# EAGLE design nixie-tube-clock_tube (EAGLE 9.6.2)
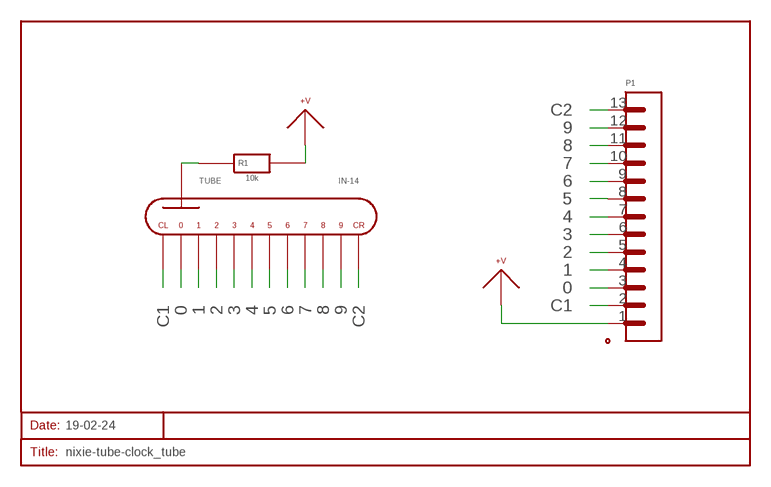
[diagram p0: schematic, sheet 1]

## Parts
P1  PORT_13-PIN_HEADER  [HEADER_13-PIN]
R1  10k  RESISTOR  [RESISTOR_10.16MM]
SCHEMATIC1  19-02-24  SHEET  [SHEET]
TUBE  IN-14  NIXIE-TUBE_IN-14_TUBE  [NIXIE-TUBE_IN-14]

## Nets
0: P1.3 TUBE.0
1: P1.4 TUBE.1
2: P1.5 TUBE.2
3: P1.6 TUBE.3
4: P1.7 TUBE.4
5: P1.8 TUBE.5
6: P1.9 TUBE.6
7: P1.10 TUBE.7
8: P1.11 TUBE.8
9: P1.12 TUBE.9
+V: P1.1 R1.2
C1: P1.2 TUBE.C1
C2: P1.13 TUBE.C2
N$1: R1.1 TUBE.A(ANODE)

## Library data of the parts
P1 = myLibrary:PORT_13-PIN
R1 = myLibrary:RESISTOR
SCHEMATIC1 = myLibrary:SHEET
TUBE = myLibrary:NIXIE-TUBE_IN-14

## Board
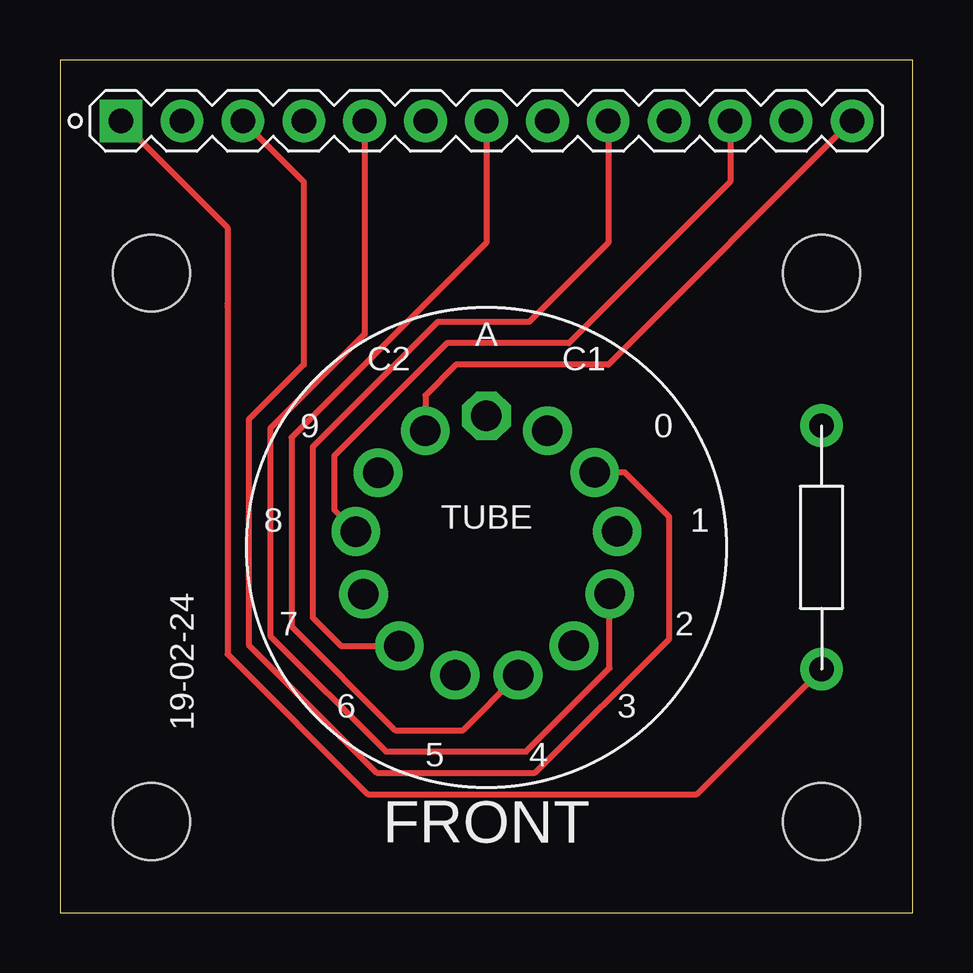
[diagram p1: board, top side]
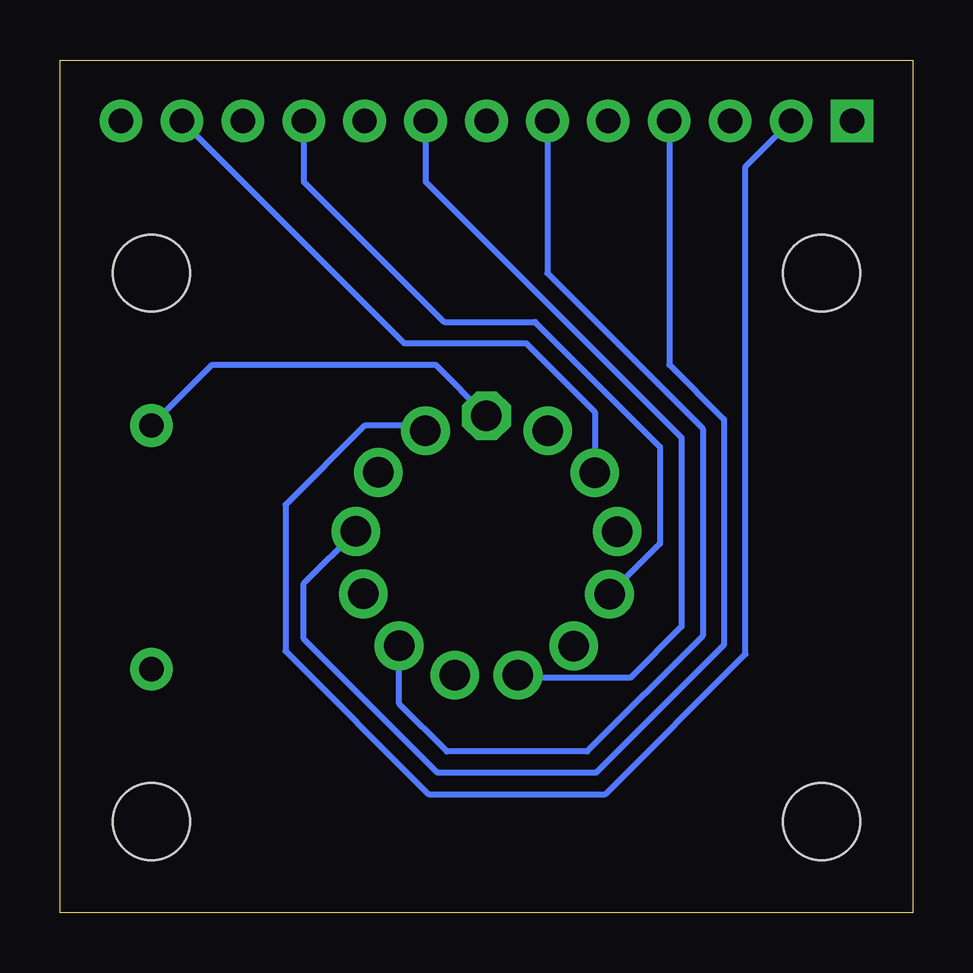
[diagram p2: board, bottom side, seen from below]

Size 35.56 x 35.56 mm. Coordinates in mm from the lower left corner, seen from the top.
Outline: 0,0 35.56,0 35.56,35.56 0,35.56 0,0
Copper layers (1*16): Top 0.035mm / dielectric 1.5mm / Bottom 0.035mm
Design rules "default": minimum track width 6mil, minimum drill 0.35mm, track to track 6mil, track to pad 6mil, pad to pad 6mil, via to via 6mil, smd to smd 6mil, copper to edge 40mil, drill to drill 6mil, minimum pad ring 10mil, minimum via ring 8mil, stop-mask expansion 4mil, vias tented up to drill 0mil, thermal gap 10mil
Holes 3.2 mm at 3.81,3.81 31.75,3.81 3.81,26.67 31.75,26.67

### Footprints (pad centres in the part's own frame; a part is rotated, then mirrored left to right if it is on the bottom)
HEADER_13-PIN = drill 1.016 pad 1.778 square: 1 0,0 | drill 1.016 pad 1.778: 2 0,2.54; 3 0,5.08; 4 0,7.62; 5 0,10.16; 6 0,12.7; 7 0,15.24; 8 0,17.78; 9 0,20.32; 10 0,22.86; 11 0,25.4; 12 0,27.94; 13 0,30.48
RESISTOR_10.16MM = drill 1.016 pad 1.778: 1 -5.08,0; 2 5.08,0
NIXIE-TUBE_IN-14 = drill 1.27 pad 2.032: 0 4.511,3.123; 1 5.446,0.669; 2 5.132,-1.939; 3 3.643,-4.103; 4 1.318,-5.326; 5 -1.309,-5.328; 6 -3.635,-4.109; 7 -5.129,-1.948; 8 -5.447,0.659; 9 -4.516,3.115; C1 2.542,4.862; C2 -2.55,4.858 | drill 1.27 pad 2.032 octagon: A 0,5.486

### Placement (x,y rotation side)
P1  2.54,33.02 270 top
R1  31.75,15.24 270 top
SCHEMATIC1  3.81,7.62 90 top
TUBE  17.78,15.24 0 top

### Tracks (layer width: path | path; a pad name or v marks a point on that pad's centre or on a via)
0
  Top 0.254: P1.3 10.16,30.48 10.16,22.86 7.87,20.57 7.87,11.18 13.21,5.84 19.81,5.84 25.4,11.43 25.4,16.51 23.55,18.36 TUBE.0
1
  Bottom 0.254: P1.4 10.16,22.86 7.87,20.57 7.87,11.18 13.21,5.84 19.81,5.84 25.4,11.43 25.4,13.73 TUBE.1
2
  Top 0.254: P1.5 12.7,24.13 8.76,20.19 8.76,11.56 13.59,6.73 19.43,6.73 22.91,10.21 TUBE.2
3
  Bottom 0.254: P1.6 15.24,26.67 8.76,20.19 8.76,11.56 13.59,6.73 19.43,6.73 21.42,8.72 TUBE.3
4
  Top 0.254: P1.7 17.78,27.94 9.65,19.81 9.65,11.94 13.97,7.62 16.8,7.62 TUBE.4
5
  Bottom 0.254: P1.8 20.32,30.48 9.65,19.81 9.65,11.94 11.79,9.8 16.36,9.8 TUBE.5
6
  Top 0.254: P1.9 22.86,27.94 19.56,24.64 15.75,24.64 10.54,19.43 10.54,12.32 11.73,11.13 TUBE.6
7
  Bottom 0.254: P1.10 25.4,30.48 19.56,24.64 15.75,24.64 10.54,19.43 10.54,15.4 TUBE.7
8
  Top 0.254: P1.11 27.94,30.48 21.21,23.75 16.13,23.75 11.43,19.05 11.43,16.8 TUBE.8
9
  Bottom 0.254: P1.12 21.21,23.75 16.13,23.75 13.26,20.88 TUBE.9
+V
  Top 0.254: P1.1 6.99,28.57 6.99,25.4 6.99,25.27 6.99,10.79 12.83,4.95 26.54,4.95 R1.2
C1
  Bottom 0.254: TUBE.C1 20.54,20.32 22.86,20.32 26.16,17.02 26.16,10.92 20.19,4.95 12.83,4.95 6.99,10.79 6.99,31.11 P1.2
C2
  Top 0.254: P1.13 22.86,22.86 16.51,22.86 15.23,21.58 TUBE.C2
N$1
  Bottom 0.254: R1.1 29.21,22.86 19.91,22.86 TUBE.A